# Altium schematic sheet SCD41_schema.SchDoc
size A4; SheetNumber: 1; SheetTotal: 1
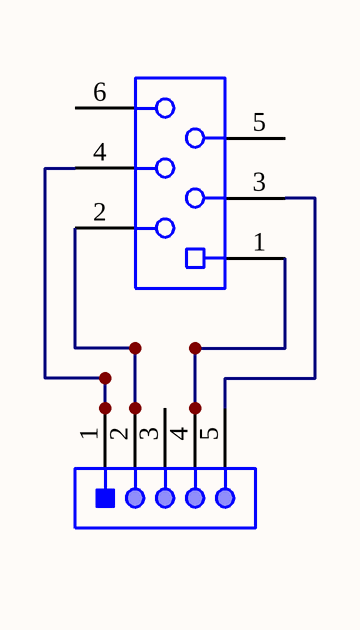
[diagram p0: SCD41_schema.SchDoc]

## Parts
(Parts that share a designator on the sheet are numbered #1, #2 ... from top to bottom, then left to right.)
?#1  (no value)  [690367280676]
?#2  (no value)  [61300511121]

## Nets
Net?#1_1: ?#1.1 ?#2.4
Net?#1_2: ?#1.2 ?#2.2
Net?#1_3: ?#1.3 ?#2.5
Net?#1_4: ?#1.4 ?#2.1

Not connected (* = marked no-connect by the designer): ?#1 5 6; ?#2 3

## Library data of the parts
?#1 = CMP-1502-00818-1: Female SMT Straight Connector without Latch and with Polarization WR-MM, 6 pins; Manufacturer: Wurth Elektronik; Working Voltage: 100VAC; Pin Number: 6; Rated Current: 1.5A; Contact Resistance: 10mOhm; Pitch: 2.54mm; Insulation Resistance: >1000MOhm; Withstanding Voltage: 500VAC; Manufacturer URL: http://www.we-online.de; Datasheet URL: https://katalog.we-online.de/em/datasheet/690367280676.pdf; Package Reference: 690367280676; Mounting Technology: SMT; Operating Temperature: -40to105degC; Gender: Female; Part Number: 690367280676; Packaging: TapeandReel; Publisher: WurthElektronik
?#2 = CMP-1502-01068-1: THT Vertical Pin Header WR-PHD, Pitch 2.54 mm, Single Row, 5 pins; Manufacturer: Wurth Elektronik; Pin Number: 5; Contact Resistance: 20mOhm; Working Voltage: 250VAC; Pitch: 2.54mm; Withstanding Voltage: 500VAC; Rated Current: 3A; Gender: Male; Datasheet URL: https://katalog.we-online.de/em/datasheet/6130xx11121.pdf; Orientation: Vertical; Mounting Technology: THT; Row Number: Single; Package Reference: 61300511121; Publisher: WurthElektronik; Part Number: 61300511121; Packaging: Bag; Manufacturer URL: http://www.we-online.de; Operating Temperature: -40to105degC